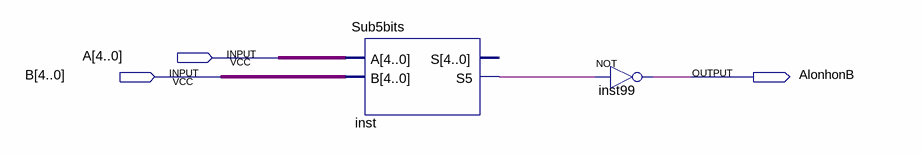
[diagram p0: schematic sheet]
// Quartus schematic SoSanh5bits.bdf as structural Verilog: 2 symbols, 3 pins
module SoSanh5bits (
  input  [4:0] A,
  input  [4:0] B,
  output AlonhonB
);

  wire inst_s5;

  Sub5bits inst (.A(A), .B(B), .S5(inst_s5));  // open: S
  not inst99 (AlonhonB, inst_s5);
endmodule
